# Altium schematic sheet SCH_04_WCT_RLD.SchDoc
size A4; SheetNumber: 10; SheetTotal: 14; SPICEModelCacheSEOKWNHP: <root> / <DocumentId>SEOKWNHP</DocumentId> / <CacheFrame Number="0"> / <Model Name="0603_885012206089_10nf" Kind="CKT"> / <Text>******* / .subckt 0603_885012206089_10nF 1 2 / Rser 1 3 0.0358532866879 / Lser 2 4 3.4059544E-10 / C1 3 4 0.00000001 / Rpar 3 4 10000000000 / .ends 0603_885012206089_10nF</Text> / </Model> / <Model Name="0603_885012206095_100nf" Kind="CKT"> / <Text>******* / .subckt 0603_885012206095_100nF 1 2 / Rser 1 3 0.0157659152881 / Lser 2 4 3.10171966E-10 / C1 3 4 0.0000001 / Rpar 3 4 5000000000 / .ends 0603_885012206095_100nF</Text> / </Model> / </CacheFrame> / </root>
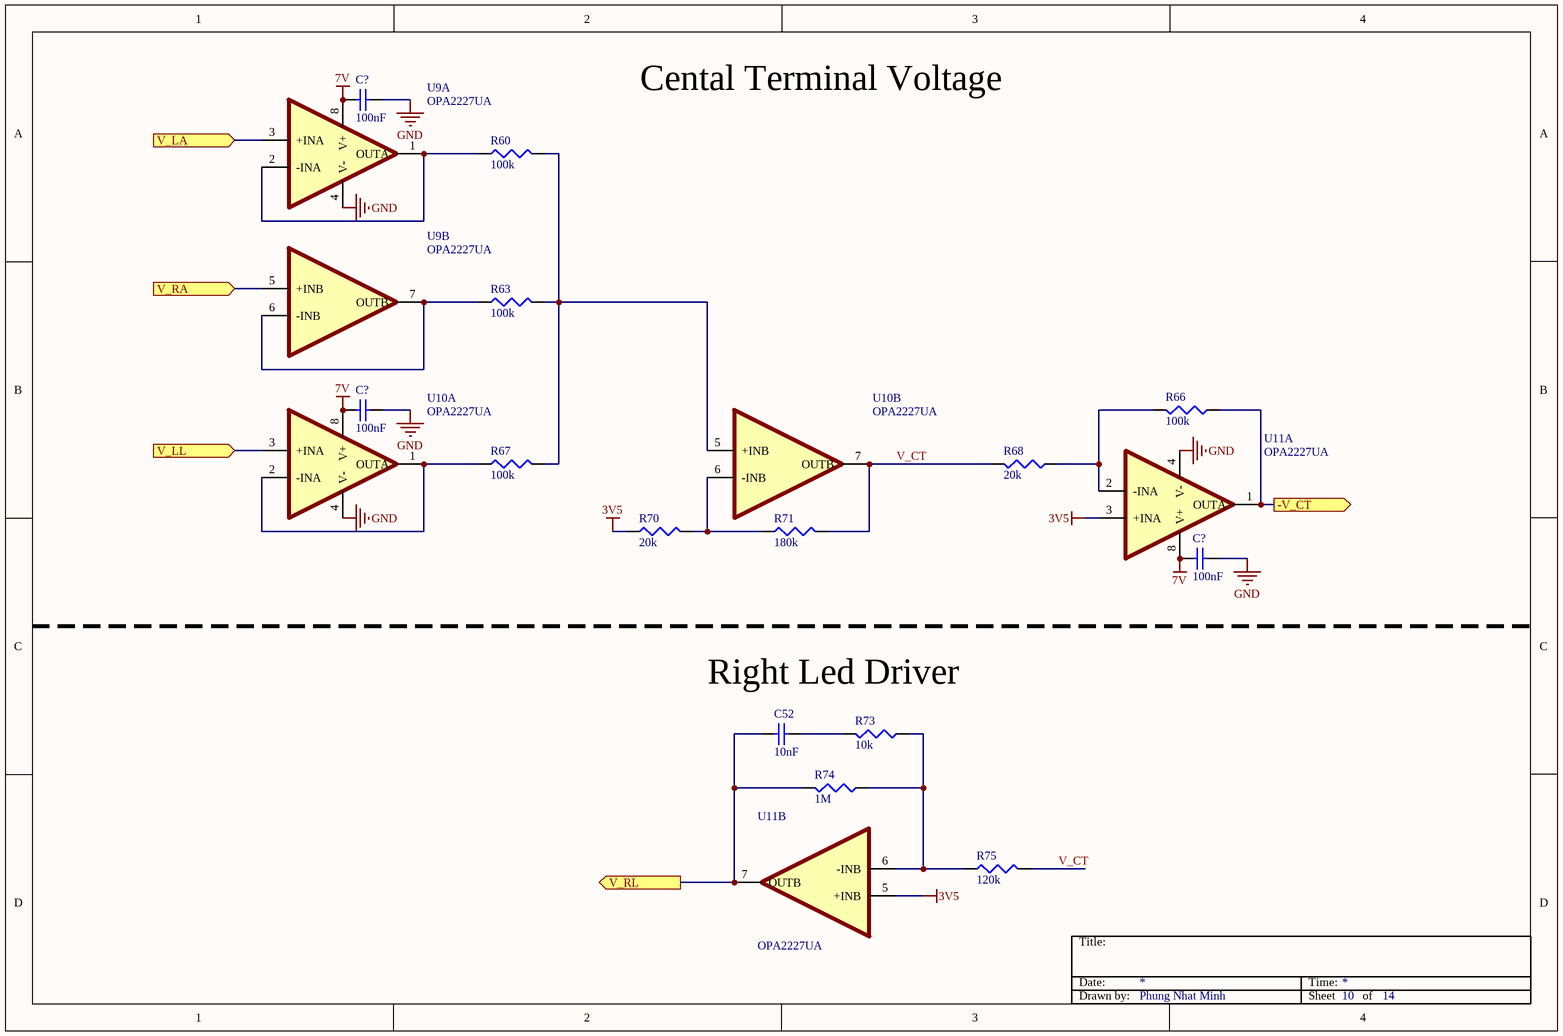
[diagram p0: SCH_04_WCT_RLD.SchDoc]

## Parts
(Parts that share a designator on the sheet are numbered #1, #2 ... from top to bottom, then left to right.)
C52  10nF  [WCAP-CSGP_0603_L1.6W0.8H0.8_Reflow]
C?#1  100nF  [WCAP-CSGP_0603_L1.6W0.8H0.8_Reflow]
C?#2  100nF  [WCAP-CSGP_0603_L1.6W0.8H0.8_Reflow]
C?#3  100nF  [WCAP-CSGP_0603_L1.6W0.8H0.8_Reflow]
R60  100k  [WRIS-PSMB_0603_L1.6W0.8H0.35]
R63  100k  [WRIS-PSMB_0603_L1.6W0.8H0.35]
R66  100k  [WRIS-PSMB_0603_L1.6W0.8H0.35]
R67  100k  [WRIS-PSMB_0603_L1.6W0.8H0.35]
R68  20k  [WRIS-PSMB_0603_L1.6W0.8H0.35]
R70  20k  [WRIS-PSMB_0603_L1.6W0.8H0.35]
R71  180k  [WRIS-PSMB_0603_L1.6W0.8H0.35]
R73  10k  [WRIS-PSMB_0603_L1.6W0.8H0.35]
R74  1M  [WRIS-PSMB_0603_L1.6W0.8H0.35]
R75  120k  [WRIS-PSMB_0603_L1.6W0.8H0.35]
U9  OPA2227UA  [SOIC127P599X175-8N]  (parts A,B of 2)
U10  OPA2227UA  [SOIC127P599X175-8N]  (parts A,B of 2)
U11  OPA2227UA  [SOIC127P599X175-8N]  (parts A,B of 2)

## Ports
-V_CT (out, see Schematic_Top[2B], SCH_05_Analog_Mux[2B]), V_LA (in, see Schematic_Top[1B], SCH_02_Electrodes[2A], SCH_03_Instrumentation_Amplifier[1A]), V_LL (in, see Schematic_Top[1B], SCH_02_Electrodes[2B], SCH_03_Instrumentation_Amplifier[1A]), V_RA (in, see Schematic_Top[1B], SCH_02_Electrodes[2A], SCH_03_Instrumentation_Amplifier[1A]), V_RL (out, see Schematic_Top[1B], SCH_02_Electrodes[2C])

## Nets
3V5: R70.1 U11.3(+INA) U11.5(+INB)
7V: C?#1.2 C?#2.2 C?#3.2 U9.8(V+) U10.8(V+) U11.8(V+)
GND: C?#1.1 C?#2.1 C?#3.1 U9.4(V-) U10.4(V-) U11.4(V-)
-V_CT: R66.2 U11.1(OUTA) ; port -V_CT
V_CT: R68.1 R71.2 R75.2 U10.7(OUTB)
V_LA: U9.3(+INA) ; port V_LA
V_LL: U10.3(+INA) ; port V_LL
V_RA: U9.5(+INB) ; port V_RA
V_RL: C52.2 R74.2 U11.7(OUTB) ; port V_RL
NetC52_1: C52.1 R73.2
NetR60_1: R60.1 U9.1(OUTA) U9.2(-INA)
NetR60_2: R60.2 R63.2 R67.2 U10.5(+INB)
NetR63_1: R63.1 U9.6(-INB) U9.7(OUTB)
NetR66_1: R66.1 R68.2 U11.2(-INA)
NetR67_1: R67.1 U10.1(OUTA) U10.2(-INA)
NetR70_2: R70.2 R71.1 U10.6(-INB)
NetR73_1: R73.1 R74.1 R75.1 U11.6(-INB)

## Notes on the sheet
- Cental Terminal Voltage
- Right Led Driver
- Title:
- Date:
- Time:
- Drawn by:
- Phung Nhat Minh
- Sheet
- of

## Library data of the parts
C52 = 885012206089: WCAP-CSGP Multilayer Ceramic Chip Capacitor, General Purpose, size 0603, X7R, 10nF, 50VDC; Manufacturer: Wurth Elektronik; Case/Size Code: 0603; Capacitance Tolerance: +/-10%; Dissipation Factor: 2.5%; Insulation Resistance: 10GOhm; Rated Voltage (DC): 50V; Technical Reference: X7R0603103K050DFCT10000; Manufacturer Part Number: 885012206089; Category: Multilayer Ceramic Chip Capacitors; Match Code: WCAP-CSGP; ComponentLink1Description: Website Link; ComponentLink1URL: https://www.we-online.com/redexpert/article/885012206089?ad; ComponentLink2Description: Datasheet Link; ComponentLink2URL: https://www.we-online.com/redexpert/spec/885012206089?ad; Mount: Surface Mount; Operating Temperature Max: 125°C; Operating Temperature Min: -55°C; Packaging: Tape and Reel; Length: 1.6mm; Width: 0.8mm; Height: 0.8mm; Capacitance: 10nF; Ceramic Type: X7R
C?#1-C?#3 = 885012206095: WCAP-CSGP Multilayer Ceramic Chip Capacitor, General Purpose, size 0603, X7R, 100nF, 50VDC; Manufacturer: Wurth Elektronik; Case/Size Code: 0603; Capacitance Tolerance: +/-10%; Dissipation Factor: 3%; Insulation Resistance: 5GOhm; Rated Voltage (DC): 50V; Technical Reference: X7R0603104K050DFCT10000; Manufacturer Part Number: 885012206095; Category: Multilayer Ceramic Chip Capacitors; Match Code: WCAP-CSGP; ComponentLink1Description: Website Link; ComponentLink1URL: https://www.we-online.com/redexpert/article/885012206095?ad; ComponentLink2Description: Datasheet Link; ComponentLink2URL: https://www.we-online.com/redexpert/spec/885012206095?ad; Mount: Surface Mount; Operating Temperature Max: 125°C; Operating Temperature Min: -55°C; Packaging: Tape and Reel; Length: 1.6mm; Width: 0.8mm; Height: 0.8mm; Capacitance: 100nF; Ceramic Type: X7R
R60 R63 R66-R68 R70 R71 R73-R75 = 580060716001: WRIS-PSMB Metal Plate Resistor, SMT, size 0603, 0.33W, 5mΩ, +/-1%; Manufacturer: Wurth Elektronik; Case/Size Code: 0603; Rated Current: 8.12A; Technical Reference: MB0603R005F103KAATP0000; Temperature Coefficient of Resistance: +/-100ppm/°C; Manufacturer Part Number: 580060716001; Category: Metal Plate Resistors; Match Code: WRIS-PSMB; ComponentLink1Description: Website Link; ComponentLink1URL: https://www.we-online.com/redexpert/article/580060716001?ad; ComponentLink2Description: Datasheet Link; ComponentLink2URL: https://www.we-online.com/redexpert/spec/580060716001?ad; Mount: Surface Mount; Operating Temperature Max: 155°C; Operating Temperature Min: -55°C; Packaging: Tape and Reel; Length: 1.6mm; Width: 0.8mm; Height: 0.35mm; Rated Power: 0.33W; Resistance: 5mΩ; Resistance Tolerance: +/-1%
U9-U11 = OPA2227UA: Package: None; Price: None; Value: *; MP: OPA2227UA; Availability: Unavailable